# Altium schematic sheet Sheet1.SchDoc
size A
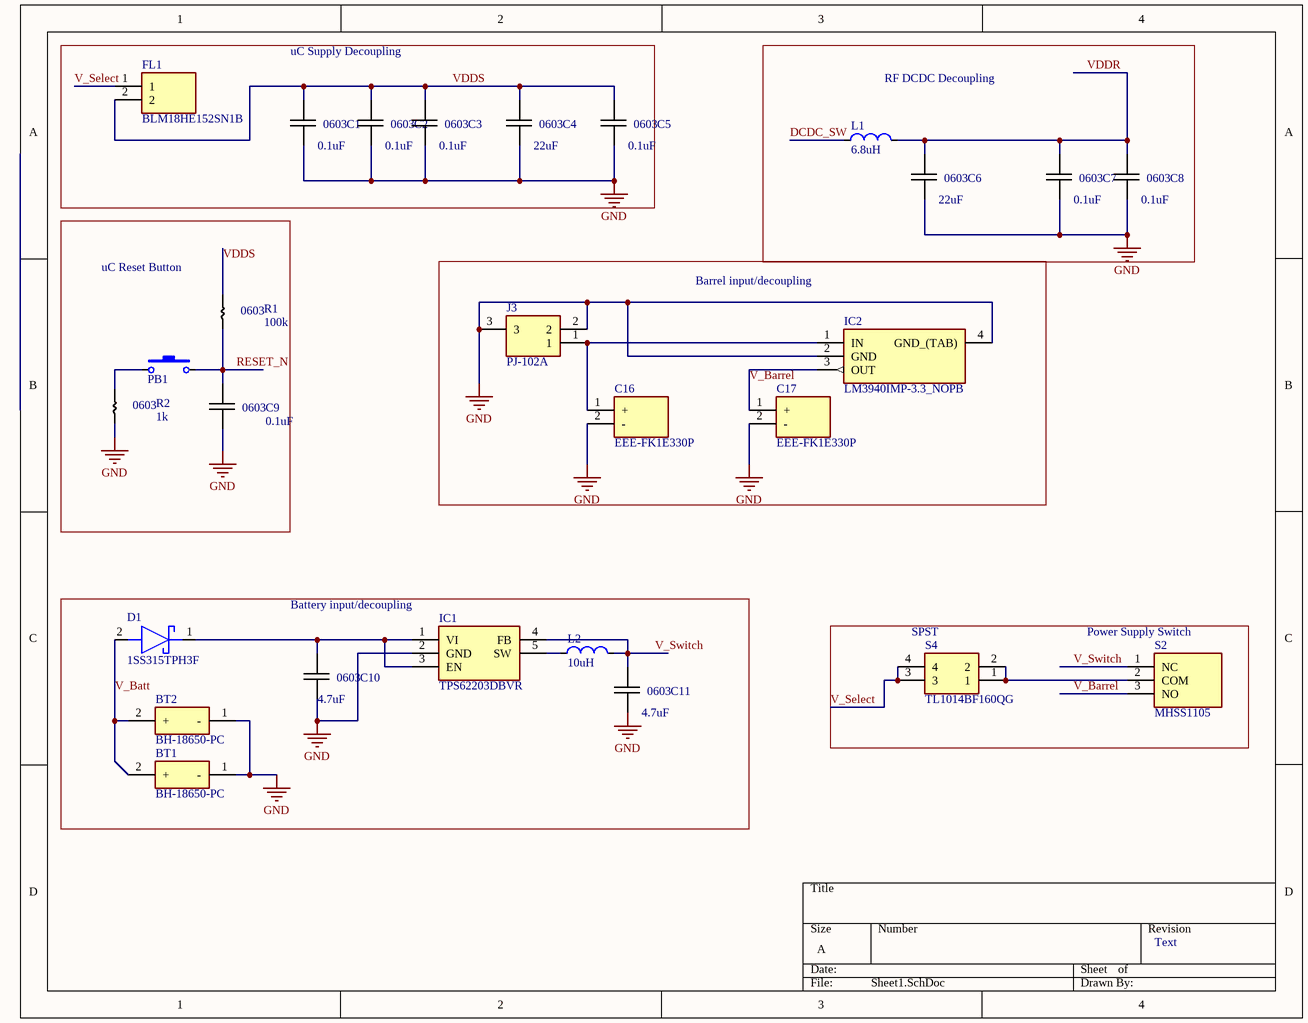
[diagram p0: Sheet1.SchDoc]

## Parts
BT1  BH-18650-PC  [BH18650PC]
BT2  BH-18650-PC  [BH18650PC]
C1  0.1uF  [0603_SMD]
C2  0.1uF  [0603_SMD]
C3  0.1uF  [0603_SMD]
C4  22uF  [0603_SMD]
C5  0.1uF  [0603_SMD]
C6  22uF  [0603_SMD]
C7  0.1uF  [0603_SMD]
C8  0.1uF  [0603_SMD]
C9  0.1uF  [0603_SMD]
C10  4.7uF  [0603_SMD]
C11  4.7uF  [0603_SMD]
C16  EEE-FK1E330P  [CAPAE660X610N]
C17  EEE-FK1E330P  [CAPAE660X610N]
D1  1SS315TPH3F  [SOD2513X110N]
FL1  BLM18HE152SN1B  [BEADC1608X95N]
IC1  TPS62203DBVR  [SOT95P280X145-5N]
IC2  LM3940IMP-3.3_NOPB  [SOT230P700X180-4N]
J3  PJ-102A  [PJ-102AH]
L1  value 6.8uH  [PASSIVE-INDUCTOR-0603]  (hidden comment: Passive-Inductor (Generic))
L2  value 10uH  [PASSIVE-INDUCTOR-0603]  (hidden comment: Passive-Inductor (Generic))
PB1  Interface-Push-Button  [INTERFACE-PUSH-BUTTON]  (value not drawn)
R1  100k  [0603_SMD]
R2  1k  [0603_SMD]
S2  MHSS1105  [MHSS1105]
S4  TL1014BF160QG  [TL1014BF160QG]

## Blocks framed on the sheet
uC Supply Decoupling: C1-C5 FL1
RF DCDC Decoupling: C6-C8 L1
uC Reset Button: C9 PB1 R1 R2
Barrel input/decoupling: C16 C17 IC2 J3
Battery input/decoupling: BT1 BT2 C10 C11 D1 IC1 L2

## Nets
GND: BT1.1(-) BT2.1(-) C1.1 C2.1 C3.1 C4.1 C5.1 C6.1 C7.1 C8.1 C9.1 C10.1 C11.1 C16.2(-) C17.2(-) IC1.2(GND) IC2.2(GND) IC2.4(GND_(TAB)) J3.2 J3.3 R2.2
DCDC_SW: L1.1
RESET_N: C9.2 PB1.2 R1.2
V_Barrel: C17.1(+) IC2.3(OUT) S2.3(NO)
V_Batt: BT1.2(+) BT2.2(+) D1.2(A)
V_Select: FL1.1 S4.3 S4.4
V_Switch: C11.2 IC1.4(FB) L2.2 S2.1(NC)
VDDR: C6.2 C7.2 C8.2 L1.2
VDDS: C1.2 C2.2 C3.2 C4.2 C5.2 FL1.2 R1.1
NetC10_2: C10.2 D1.1(K) IC1.1(VI) IC1.3(EN)
NetC16_1: C16.1(+) IC2.1(IN) J3.1
NetIC1_5: IC1.5(SW) L2.1
NetPB1_1: PB1.1 R2.1
NetS2_2: S2.2(COM) S4.1 S4.2

## Notes on the sheet
- (near S4) SPST
- (near S2) Power Supply Switch
- Text
- (in symbol C_0603) 0603
- (in symbol R_0603) 0603

## Library data of the parts
BT1 BT2 = BH-18650-PC: Battery; Manufacturer_Name: MPD (Memory Protection Devices); Datasheet Link: http://www.memoryprotectiondevices.com/datasheets/BH-18650-PC-datasheet.pdf; Height: 21.31mm; Manufacturer_Part_Number: BH-18650-PC
C1-C11 = C_0603
C16 C17 = EEE-FK1E330P: Capacitor Polarised; Manufacturer_Name: Panasonic; Allied_Number: 70258257; Datasheet Link: https://industrial.panasonic.com/cdbs/www-data/pdf/RDE0000/ABA0000C1181.pdf; Height: 6.1mm; Manufacturer_Part_Number: EEE-FK1E330P; Mouser Part Number: 667-EEE-FK1E330P; Mouser Price/Stock: https://www.mouser.com/Search/Refine.aspx?Keyword=667-EEE-FK1E330P; Allied Price/Stock: https://www.alliedelec.com/panasonic-eee-fk1e330p/70258257/
D1 = 1SS315TPH3F: Schottky Diode; Manufacturer_Name: Toshiba; Datasheet Link: http://toshiba.semicon-storage.com/info/docget.jsp?did=2666&prodName=1SS315; Height: 1.1mm; Manufacturer_Part_Number: 1SS315TPH3F; Mouser Part Number: 757-1SS315TPH3F; Mouser Price/Stock: https://www.mouser.com/Search/Refine.aspx?Keyword=757-1SS315TPH3F
FL1 = BLM18HE152SN1B: Filter; Manufacturer_Name: Murata Electronics; Datasheet Link: https://www.murata.com/en-us/products/productdetail?partno=BLM18HE152SN1%23; Height: 0.95mm; Manufacturer_Part_Number: BLM18HE152SN1B; Mouser Part Number: N/A; Mouser Price/Stock: https://www.mouser.com/Search/Refine.aspx?Keyword=N%2FA
IC1 = TPS62203DBVR: Integrated Circuit; Manufacturer_Name: Texas Instruments; Datasheet Link: http://www.ti.com/lit/ds/symlink/tps62203.pdf; Height: 1.45mm; Manufacturer_Part_Number: TPS62203DBVR; Mouser Part Number: 595-TPS62203DBVR; Mouser Price/Stock: https://www.mouser.com/Search/Refine.aspx?Keyword=595-TPS62203DBVR
IC2 = LM3940IMP-3.3_NOPB: Integrated Circuit; Manufacturer_Name: Texas Instruments; Manufacturer_Part_Number: LM3940IMP-3.3/NOPB; Datasheet Link: http://www.ti.com/lit/ds/symlink/lm3940.pdf; Height: 1.8mm; Mouser Part Number: 926-LM3940IMP3.3NOPB; Mouser Price/Stock: https://www.mouser.com/Search/Refine.aspx?Keyword=926-LM3940IMP3.3NOPB; RS Part Number: 5361546P; RS Price/Stock: http://uk.rs-online.com/web/p/products/5361546P
J3 = PJ-102A: Connector; Manufacturer_Name: CUI; Datasheet Link: https://www.cui.com/product/resource/pj-102a.pdf; Manufacturer_Part_Number: PJ-102A; Mouser Part Number: 490-PJ-102A; Mouser Price/Stock: https://www.mouser.com/Search/Refine.aspx?Keyword=490-PJ-102A
L1 L2 = Passive-Inductor (Generic): Generic Inductor; Category: Passive; Manufacturer: *; Supplier 2: Digi-Key; Manufacturer Part Number: *; Supplier 1: Mouser; Package: *; Supplier Part Number 1: *; Supplier Part Number 2: *; Through Hole (y/n): *
PB1 = Interface-Push-Button: 2.5mm Tall, 2.5N Force, Straight, SMD, Push Button; Manufacturer: C&K Components; Manufacturer Part Number: PTS820 J25K SMTR LFS; Value: Single; Through Hole (y/n): N; ComponentLink1Description: Datasheet; ComponentLink1URL: https://www.mouser.com/datasheet/2/60/pts820-1382642.pdf; Category: Interface; Package: SMD-6; Supplier 1: Mouser; Supplier Part Number 1: 611-PTS820J25KSMTR; Supplier 2: Digi-Key; Supplier Part Number 2: CKN10897CT-ND
R1 R2 = R_0603
S2 = MHSS1105: Switch; Manufacturer_Name: Apem; Datasheet Link: https://componentsearchengine.com/Datasheets/2/MHSS1105.pdf; Height: 4mm; Manufacturer_Part_Number: MHSS1105; Mouser Part Number: 642-MHSS1105; Mouser Price/Stock: https://www.mouser.com/Search/Refine.aspx?Keyword=642-MHSS1105
S4 = TL1014BF160QG: Switch; Manufacturer_Name: E-Switch; Datasheet Link: https://www.e-switch.com/system/asset/product_line/data_sheet/141/TL1014.pdf; Height: 1mm; Manufacturer_Part_Number: TL1014BF160QG; Mouser Part Number: 612-TL1014BF160QG; Mouser Price/Stock: https://www.mouser.com/Search/Refine.aspx?Keyword=612-TL1014BF160QG